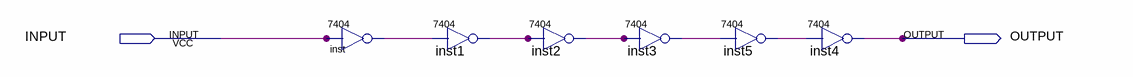
[diagram p0: schematic sheet]
// Quartus schematic REDE_RETARDO.bdf as structural Verilog: 6 symbols, 2 pins
module REDE_RETARDO (
  input  INPUT,
  output OUTPUT
);

  wire inst1_1, inst2_1, inst3_1, inst5_1, inst_1;

  \7404  inst (.\2 (INPUT), .\1 (inst_1));
  \7404  inst1 (.\2 (inst_1), .\1 (inst1_1));
  \7404  inst2 (.\2 (inst1_1), .\1 (inst2_1));
  \7404  inst3 (.\2 (inst2_1), .\1 (inst3_1));
  \7404  inst5 (.\2 (inst3_1), .\1 (inst5_1));
  \7404  inst4 (.\2 (inst5_1), .\1 (OUTPUT));
endmodule
